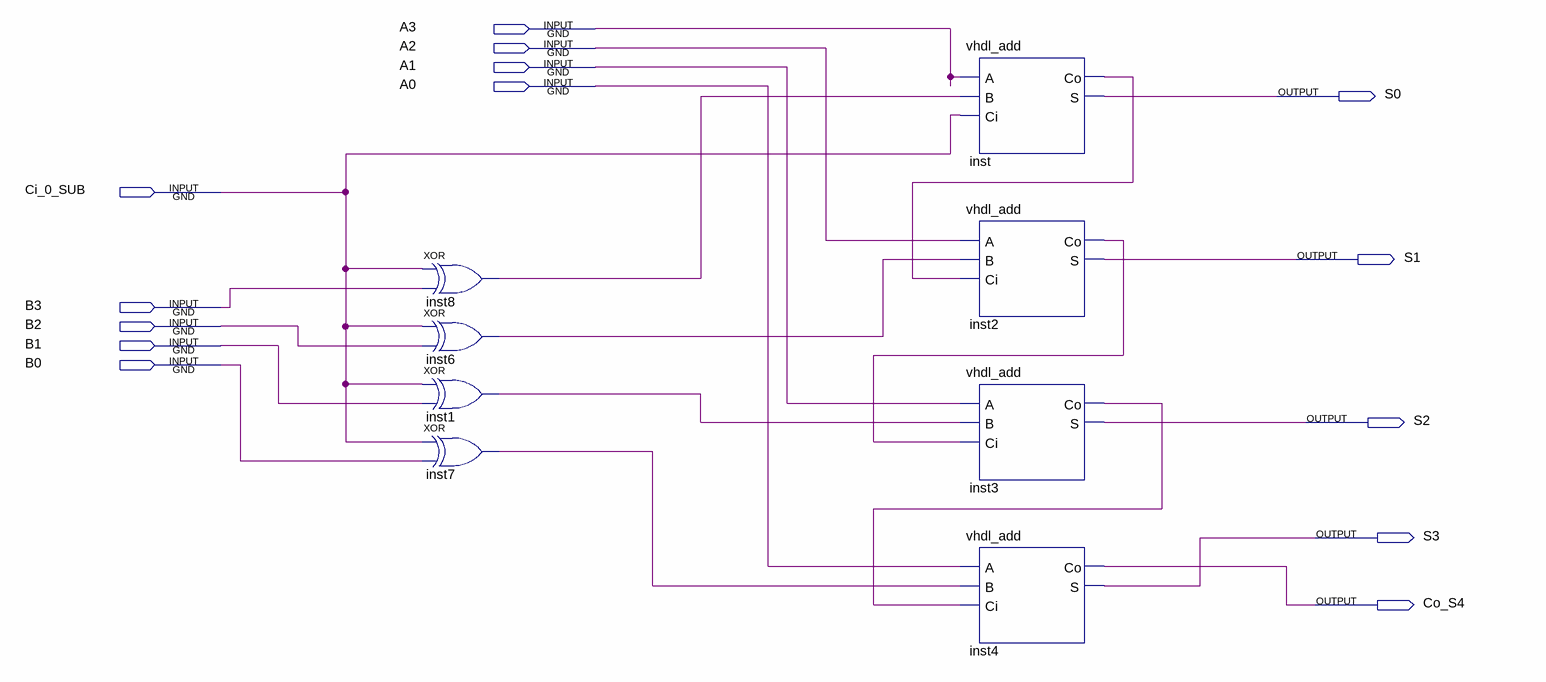
[diagram p0: schematic sheet]
// Quartus schematic FULLADD.bdf as structural Verilog: 8 symbols, 14 pins
module FULLADD (
  input  A3,
  input  A2,
  input  A1,
  input  A0,
  input  Ci_0_SUB,
  input  B3,
  input  B2,
  input  B1,
  input  B0,
  output S0,
  output S1,
  output S2,
  output S3,
  output Co_S4
);

  wire inst1_out, inst2_co, inst3_co, inst6_out, inst7_out, inst8_out, inst_co;

  xor inst8 (inst8_out, Ci_0_SUB, B3);
  xor inst6 (inst6_out, Ci_0_SUB, B2);
  xor inst1 (inst1_out, Ci_0_SUB, B1);
  xor inst7 (inst7_out, Ci_0_SUB, B0);
  vhdl_add inst (.A(A3), .B(inst8_out), .Ci(Ci_0_SUB), .Co(inst_co), .S(S0));
  vhdl_add inst2 (.A(A2), .B(inst6_out), .Ci(inst_co), .Co(inst2_co), .S(S1));
  vhdl_add inst3 (.A(A1), .B(inst1_out), .Ci(inst2_co), .Co(inst3_co), .S(S2));
  vhdl_add inst4 (.A(A0), .B(inst7_out), .Ci(inst3_co), .Co(Co_S4), .S(S3));
endmodule
